# Altium schematic sheet PowerSupply.SchDoc
size A4; SheetNumber: 3; SheetTotal: 3
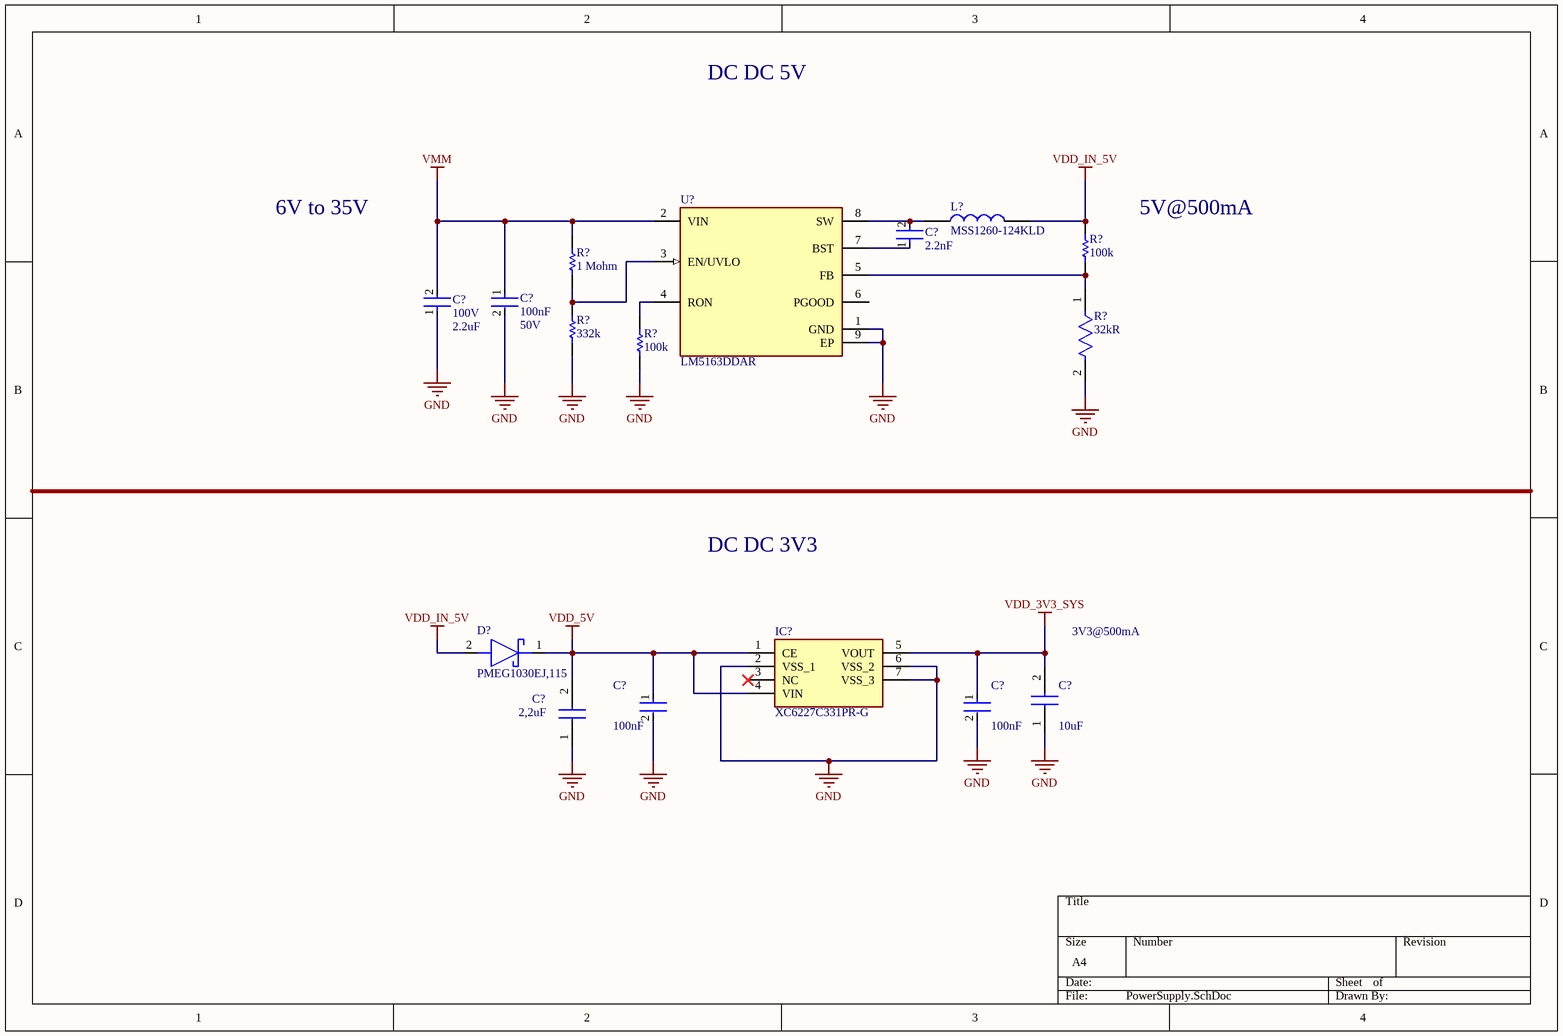
[diagram p0: PowerSupply.SchDoc]

## Parts
(Parts that share a designator on the sheet are numbered #1, #2 ... from top to bottom, then left to right.)
C?#1  Capacitance: 2.2nF  [FP-GCM155-0_05-IPC_C]  (hidden comment: GCM155R71H222KA37D)
C?#2  Capacitance: 100nF  Voltage Rating (DC): 50V  [FP-CGA3E-0_3-0_1-IPC_A]  (hidden comment: CGA3E2X7R1H104K080AA)
C?#3  Voltage Rating: 100V  Capacitance: 2.2uF  [FP-CGA6P-IPC_B]  (hidden comment: CGA6N3X7R2A225K230AB)
C?#4  Capacitance: 100nF  [FP-CGA3E-0_3-0_1-IPC_B]  (hidden comment: CGA3E2X7R1H104K080AA)
C?#5  Capacitance: 100nF  [FP-CGA3E-0_3-0_1-IPC_B]  (hidden comment: CGA3E2X7R1H104K080AA)
C?#6  value 10uF  [C0805]  (hidden comment: C0805C106K4PACTU)
C?#7  value 2,2uF  [CAPC2012X135N]  (hidden comment: GRM21BR60J225KA01L)
D?  PMEG1030EJ,115  [SODFL2512X80N]
IC?  XC6227C331PR-G  [XC6227C501PRG]
L?  MSS1260-124KLD  [INDPM122123X620N]
R?#1  value 100k  [RESC1609X55X30ML10T20]  (hidden comment: TNPW0603100KBEEN)
R?#2  value 1 Mohm  [RESC1608X55X25LL10T15]  (hidden comment: RC0603FR-071ML)
R?#3  Resistance: 32kR  [FP-RN731J-IPC_B]  (hidden comment: RN731JTTD3202F100)
R?#4  value 332k  [RESC1608X55X25NL10T15]  (hidden comment: RC0603FR-07332KL)
R?#5  value 100k  [RESC1609X55X30ML10T20]  (hidden comment: TNPW0603100KBEEN)
U?  LM5163DDAR  [FP-DDA0008E-IPC_C]

## Nets
GND: C?#2.2 C?#3.1 C?#4.2 C?#5.2 C?#6.1 C?#7.1 IC?.2(VSS_1) IC?.6(VSS_2) IC?.7(VSS_3) R?#3.2 R?#4.2 R?#5.2 U?.1(GND) U?.9(EP)
VDD_3V3_SYS: C?#5.1 C?#6.2 IC?.5(VOUT)
VDD_5V: C?#4.1 C?#7.2 D?.1(K) IC?.1(CE) IC?.4(VIN)
VDD_IN_5V: D?.2(A) L?.2 R?#1.1
VMM: C?#2.1 C?#3.2 R?#2.1 U?.2(VIN)
NetC?#1_1: C?#1.1 U?.7(BST)
NetC?#1_2: C?#1.2 L?.1 U?.8(SW)
NetR?#1_2: R?#1.2 R?#3.1 U?.5(FB)
NetR?#2_2: R?#2.2 R?#4.1 U?.3(EN/UVLO)
NetR?#5_1: R?#5.1 U?.4(RON)

Not connected (* = marked no-connect by the designer): IC? 3(NC)*; U? 6(PGOOD)

## Notes on the sheet
- DC DC 5V
- 6V to 35V
- 5V@500mA
- DC DC 3V3
- 3V3@500mA

## Library data of the parts
C?#1 = CMP-2008-03727-2: Ceramic Capacitor for Automotive 2.2nF ±10% 50VDC X7R 0402 Paper T/R; Voltage: 50V; Max Operating Temperature: 125°C; Dielectric: X7R; Height: 0.5mm; Case/Package: 0402; Case Code (Metric): 1005; Min Operating Temperature: -55°C; Packaging: Tape and Reel; Mount: Surface Mount; Depth: 0.5mm; Ratings: AEC-Q200; Lead Free: Lead Free; Radiation Hardening: No; Termination: SMD/SMT; Voltage Rating: 50V; Tolerance: 10%; Length: 1mm; Case Code (Imperial): 0402; Weight: 2.3E-05oz; Package Quantity: 1; Thickness: 0.022inch; Voltage Rating (DC): 50V; Width: 0.02inch
C?#2 C?#4 C?#5 = CMP-2000-07546-2: Cap Ceramic 100nF 50V X7R 10% Pad SMD 0603 +125°C Automotive T/R; Weight: 7.1E-05oz; Composition: Ceramic; Max Operating Temperature: 125°C; Termination: SMD/SMT; Dielectric: X7R; Length: 1.6mm; Package Quantity: 1; REACH SVHC: No SVHC; Lead Free: Lead Free; Case Code (Metric): 1608; Min Operating Temperature: -55°C; Packaging: Tape and Reel; Tolerance: 10%; Voltage Rating: 50V; Case Code (Imperial): 0603; Case/Package: 0603; Depth: 0.8mm; Radiation Hardening: No; Ratings: AEC-Q200; Mount: Surface Mount; Voltage: 50V; Thickness: 0.035inch; Width: 0.8mm; Height: 0.8mm
  C?#4 C?#5: Voltage Rating (DC): 50V; Parameter 1: *
C?#3 = CMP-08246-002435-1: Cap Ceramic 2.2uF 100V X7R 10% Pad SMD 1210 +125°C Automotive T/R; Length: 3.2mm; Width: 0.098inch; Mount: Surface Mount; Ratings: AEC-Q200; Case Code (Imperial): 1210; Case Code (Metric): 3225; Case/Package: 1210; Packaging: Tape and Reel; Thickness: 0.098inch; Max Operating Temperature: 125°C; Depth: 2.5mm; Min Operating Temperature: -55°C; Voltage Rating (DC): 100V; Height: 2.3mm; Weight: 0.000564oz; Package Quantity: 1; Tolerance: 10%; REACH SVHC: No SVHC; Termination: SMD/SMT; Lead Free: Lead Free; Dielectric: X7R; Composition: Ceramic
C?#6 = C0805C106K4PACTU: Capacitor; Manufacturer_Name: KEMET; Datasheet Link: https://content.kemet.com/datasheets/KEM_C1006_X5R_SMD.pdf; Height: 1.1mm; Manufacturer_Part_Number: C0805C106K4PACTU; Mouser Part Number: 80-C0805C106K4P; Mouser Price/Stock: https://www.mouser.co.uk/ProductDetail/KEMET/C0805C106K4PACTU?qs=LOQsJ2JwiRQzQlGR%2F0Z13g%3D%3D; Arrow Part Number: C0805C106K4PACTU; Arrow Price/Stock: https://www.arrow.com/en/products/c0805c106k4pactu/kemet-corporation
C?#7 = GRM21BR60J225KA01L: Capacitor; Manufacturer_Name: Murata Electronics; Datasheet Link: https://www.murata.com/en-global/products/productdetail?partno=GRM21BR60J225KA01%23; Height: 1.35mm; Manufacturer_Part_Number: GRM21BR60J225KA01L; Mouser Part Number: 81-GRM21R60J225KA01L; Mouser Price/Stock: https://www.mouser.co.uk/ProductDetail/Murata-Electronics/GRM21BR60J225KA01L?qs=DJY02EClX9mNbSy8m7mkKA%3D%3D; Arrow Part Number: GRM21BR60J225KA01L; Arrow Price/Stock: https://www.arrow.com/en/products/grm21br60j225ka01l/murata-manufacturing
D? = PMEG1030EJ,115: Schottky Diode; Manufacturer_Name: Nexperia; Datasheet Link: https://assets.nexperia.com/documents/data-sheet/PMEG1030EH_EJ.pdf; Height: 0.8mm; ManufacturerPart_Number: PMEG1030EJ,115; Mouser Part Number: 771-PMEG1030EJ-T/R; Mouser Price/Stock: https://www.mouser.co.uk/ProductDetail/Nexperia/PMEG1030EJ115?qs=LOCUfHb8d9vmk7P%2FuYbs5A%3D%3D; Arrow Part Number: PMEG1030EJ,115; Arrow Price/Stock: https://www.arrow.com/en/products/pmeg1030ej115/nexperia?region=asia
IC? = XC6227C331PR-G: Integrated Circuit; Manufacturer_Name: Torex; Datasheet Link: https://www.torexsemi.com/file/xc6227/XC6227.pdf; Height: 1.6mm; Manufacturer_Part_Number: XC6227C331PR-G; Mouser Part Number: 865-XC6227C331PR-G; Mouser Price/Stock: https://www.mouser.co.uk/ProductDetail/Torex-Semiconductor/XC6227C331PR-G?qs=AsjdqWjXhJ9DrPcUjKBVyw%3D%3D
L? = MSS1260-124KLD: Fixed Inductors 120uH Shld 10% 1.85A 195mOhms AECQ2; Manufacturer_Name: COILCRAFT; Geometry.Height: 6.2mm; Manufacturer_Part_Number: MSS1260-124KLD; Mouser Part Number: 994-MSS1260-124KLD; Mouser Price/Stock: https://www.mouser.co.uk/ProductDetail/Coilcraft/MSS1260-124KLD?qs=zCSbvcPd3paKD%252BcMw7fang%3D%3D; Arrow Part Number: *; Arrow Price/Stock: *; Datasheet Link: http://www.farnell.com/datasheets/1681951.pdf?_ga=2.3114224.1184920619.1597749177-523797770.1571638354
R?#1 R?#5 = CMP-2000-03686-1: Manufacturer: Vishay Dale; Part Number: TNPW0603100KBEEN
R?#2 = CMP-1659-00056-1: Chip Resistor, 1 MOhm, +/- 1%, 100 mW, -55 to 155 degC, 0603 (1608 Metric), RoHS, Tape and Reel; Voltage Rating (DC): 25 V; Tolerance: 20%; Case\Package: Radial; Min Operating Temperature: -40 degC; PackageDescription: 2-Pin Surface Mount Device, Body 1.6 x 0.8 mm; ComponentLink1Description: Manufacturer URL; Radiation Hardening: No; DatasheetVersion: Rev. 4, 02/2016; REACH SVHC: No SVHC; Length: 20 mm; Max Operating Temperature: 85 degC; Diameter: 10 mm; Packaging: Bulk; Package Quantity: 200; PackageReference: 0603; Mount: Through Hole; ComponentLink1URL: http://www.yageo.com/; ComponentLink2URL: http://www.yageo.com/documents/recent/PYu-RC_Group_51_RoHS_L_04.pdf; ComponentLink2Description: Datasheet; Width: 0 inch; Lead Pitch: 5 mm; RoHSCompliant: true; Voltage Rating: 25 V; Height: 20 mm
R?#3 = CMP-04015-052115-1: 32kΩ ±1% 0.063W, 1/16W Chip Resistor 0603 (1608 Metric) Moisture Resistant Thin Film; Temperature Coefficient: 10ppm/°C; Voltage Rating: 50V; Power Rating: 63mW; Case Code (Metric): 1608; Max Operating Temperature: 125°C; Termination: SMD/SMT; Case/Package: 0603; Case Code (Imperial): 0603; Tolerance: 1%; Packaging: Tape and Reel; Min Operating Temperature: -55°C
R?#4 = CMP-1659-00021-2: Chip Resistor, 332 KOhm, +/- 1%, 0.1 W, -55 to 155 degC, 0603 (1608 Metric), RoHS, Tape and Reel; Gender: Female; Voltage Rating: 40 V; Case\Package: Metal; Connector Type: HDMI; Mount: Surface Mount; Packaging: Tape and Reel; ComponentLink1URL: http://www.yageo.com/; Length: 15 mm; Colour: Silver; Height: 14.25 mm; Pins: 19; Package Quantity: 300; PackageReference: 0603; Contact Plating: Gold; ComponentLink2URL: http://www.yageo.com/documents/recent/PYu-RC_Group_51_RoHS_L_04.pdf; Lead Pitch: 0.5 mm; Width: 11.55 mm; ComponentLink2Description: Datasheet; PackageDescription: 2-Pin Surface Mount Device, Body 1.6 x 0.8 mm; RoHSCompliant: true; REACH SVHC: No SVHC; DatasheetVersion: Rev. 4, 02/2016; Contact Material: Copper; ComponentLink1Description: Manufacturer URL
U? = CMP-04918-000374-1: LM5163 PRODUCTION COMMERCIAL